# Altium schematic sheet 09_FPGA_HSIO_B4.SchDoc
size A3; DocumentNumber: 9; SheetNumber: 9; SheetTotal: 21
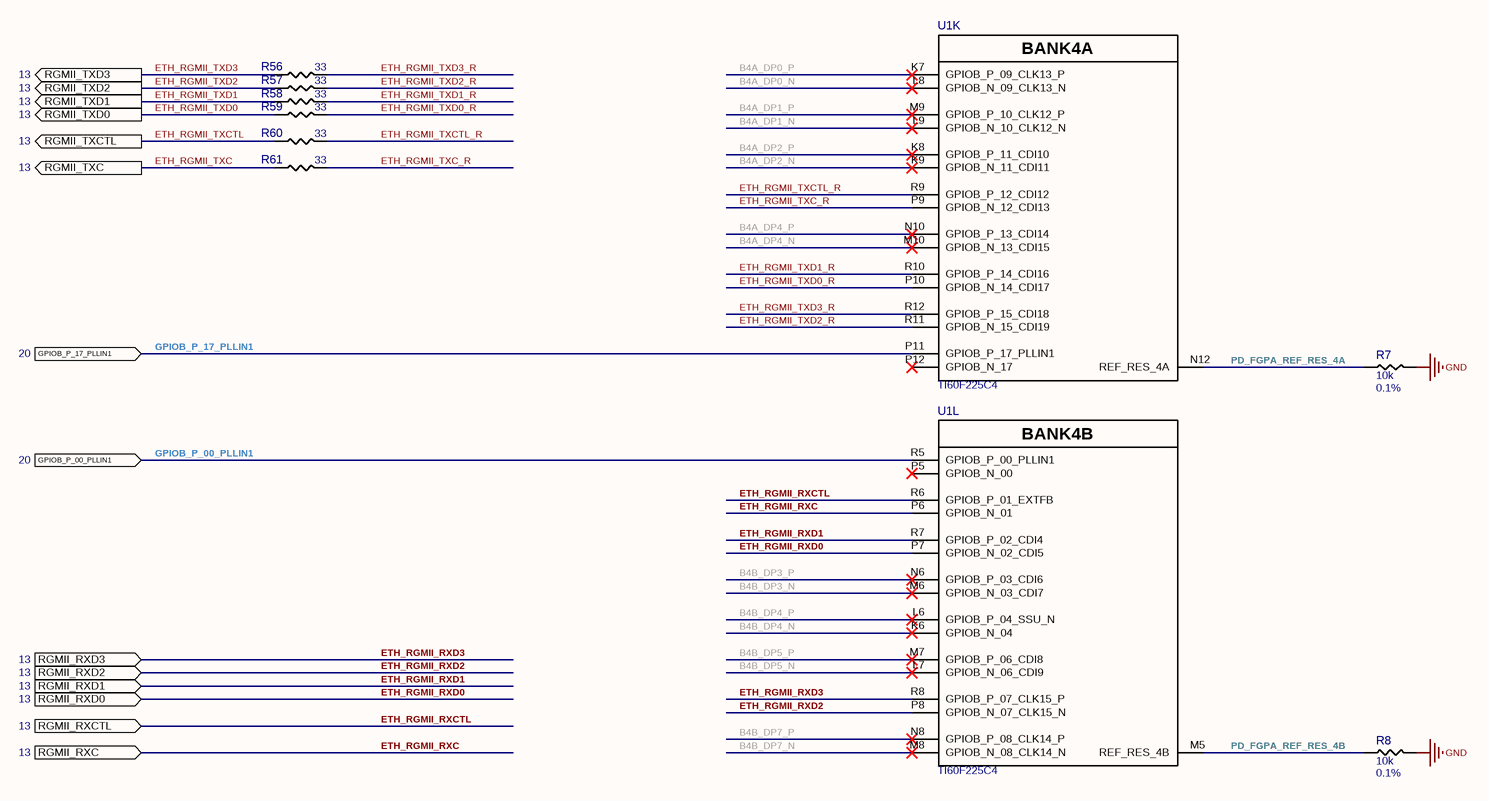
[diagram p0: 09_FPGA_HSIO_B4.SchDoc]

## Parts
R7  10k  Tol: 0.1%  [RESC1005X03N]
R8  10k  Tol: 0.1%  [RESC1005X03N]
R56  33  [RESC1005X03N]
R57  33  [RESC1005X03N]
R58  33  [RESC1005X03N]
R59  33  [RESC1005X03N]
R60  33  [RESC1005X03N]
R61  33  [RESC1005X03N]
U1  TI60F225C4  [BGA225C65P15X15_1000X1000X100]  (parts K,L of 13)

## Ports
GPIOB_P_00_PLLIN1 (in, see 20), GPIOB_P_17_PLLIN1 (in, see 20), RGMII_RXC (in, see 13), RGMII_RXCTL (in, see 13), RGMII_RXD0 (in, see 13), RGMII_RXD1 (in, see 13), RGMII_RXD2 (in, see 13), RGMII_RXD3 (in, see 13), RGMII_TXC (out, see 13), RGMII_TXCTL (out, see 13), RGMII_TXD0 (out, see 13), RGMII_TXD1 (out, see 13), RGMII_TXD2 (out, see 13), RGMII_TXD3 (out, see 13)

## Nets
GND: R7.2 R8.2
B4A_DP0_N: U1.L8(GPIOB_N_09_CLK13_N)
B4A_DP0_P: U1.K7(GPIOB_P_09_CLK13_P)
B4A_DP1_N: U1.L9(GPIOB_N_10_CLK12_N)
B4A_DP1_P: U1.M9(GPIOB_P_10_CLK12_P)
B4A_DP2_N: U1.K9(GPIOB_N_11_CDI11)
B4A_DP2_P: U1.K8(GPIOB_P_11_CDI10)
B4A_DP4_N: U1.M10(GPIOB_N_13_CDI15)
B4A_DP4_P: U1.N10(GPIOB_P_13_CDI14)
B4B_DP3_N: U1.M6(GPIOB_N_03_CDI7)
B4B_DP3_P: U1.N6(GPIOB_P_03_CDI6)
B4B_DP4_N: U1.K6(GPIOB_N_04)
B4B_DP4_P: U1.L6(GPIOB_P_04_SSU_N)
B4B_DP5_N: U1.L7(GPIOB_N_06_CDI9)
B4B_DP5_P: U1.M7(GPIOB_P_06_CDI8)
B4B_DP7_N: U1.M8(GPIOB_N_08_CLK14_N)
B4B_DP7_P: U1.N8(GPIOB_P_08_CLK14_P)
ETH_RGMII_RXC: U1.P6(GPIOB_N_01) ; port RGMII_RXC
ETH_RGMII_RXCTL: U1.R6(GPIOB_P_01_EXTFB) ; port RGMII_RXCTL
ETH_RGMII_RXD0: U1.P7(GPIOB_N_02_CDI5) ; port RGMII_RXD0
ETH_RGMII_RXD1: U1.R7(GPIOB_P_02_CDI4) ; port RGMII_RXD1
ETH_RGMII_RXD2: U1.P8(GPIOB_N_07_CLK15_N) ; port RGMII_RXD2
ETH_RGMII_RXD3: U1.R8(GPIOB_P_07_CLK15_P) ; port RGMII_RXD3
ETH_RGMII_TXC: R61.1 ; port RGMII_TXC
ETH_RGMII_TXC_R: R61.2 U1.P9(GPIOB_N_12_CDI13)
ETH_RGMII_TXCTL: R60.1 ; port RGMII_TXCTL
ETH_RGMII_TXCTL_R: R60.2 U1.R9(GPIOB_P_12_CDI12)
ETH_RGMII_TXD0: R59.1 ; port RGMII_TXD0
ETH_RGMII_TXD0_R: R59.2 U1.P10(GPIOB_N_14_CDI17)
ETH_RGMII_TXD1: R58.1 ; port RGMII_TXD1
ETH_RGMII_TXD1_R: R58.2 U1.R10(GPIOB_P_14_CDI16)
ETH_RGMII_TXD2: R57.1 ; port RGMII_TXD2
ETH_RGMII_TXD2_R: R57.2 U1.R11(GPIOB_N_15_CDI19)
ETH_RGMII_TXD3: R56.1 ; port RGMII_TXD3
ETH_RGMII_TXD3_R: R56.2 U1.R12(GPIOB_P_15_CDI18)
GPIOB_P_00_PLLIN1: U1.R5(GPIOB_P_00_PLLIN1) ; port GPIOB_P_00_PLLIN1
GPIOB_P_17_PLLIN1: U1.P11(GPIOB_P_17_PLLIN1) ; port GPIOB_P_17_PLLIN1
PD_FGPA_REF_RES_4A: R7.1 U1.N12(REF_RES_4A)
PD_FGPA_REF_RES_4B: R8.1 U1.M5(REF_RES_4B)

Not connected (* = marked no-connect by the designer): U1 P5(GPIOB_N_00)* P12(GPIOB_N_17)*

## Notes on the sheet
- (in symbol TI60F225C4, part K) BANK4A
- (in symbol TI60F225C4, part L) BANK4B

## Library data of the parts
R7 R8 = RT0402BRD0710KL: RES SMD 10K OHM 0.1% 1/16W 0402; Manufacturer 1: Yageo; Part Number: RT0402BRD0710KL; Value: 10k; Manufacturer Part Number 1: RT0402BRD0710KL; Supplier 1: Digi-Key; Supplier Part Number 1: YAG1346CT-ND
R56-R61 = RC0402FR-0733RL: RES SMD 33 OHM 1% 1/16W 0402; Manufacturer 1: Yageo; Part Number: RC0402FR-0733RL; Value: 33; Tol: 1%; Manufacturer Part Number 1: RC0402FR-0733RL; Supplier 1: Digi-Key; Supplier Part Number 1: 311-33.0LRCT-ND
U1 = TI60F225C4: FPGA TITAN 140HSIO 4PLL 225BGA; Manufacturer 1: Efinix, Inc.; Part Number: TI60F225C4; Manufacturer Part Number 1: TI60F225C4; Supplier 1: Digi-Key; Supplier Part Number 1: 2134-TI60F225C4-ND